# Altium project ArduinoProMini.PrjPcb
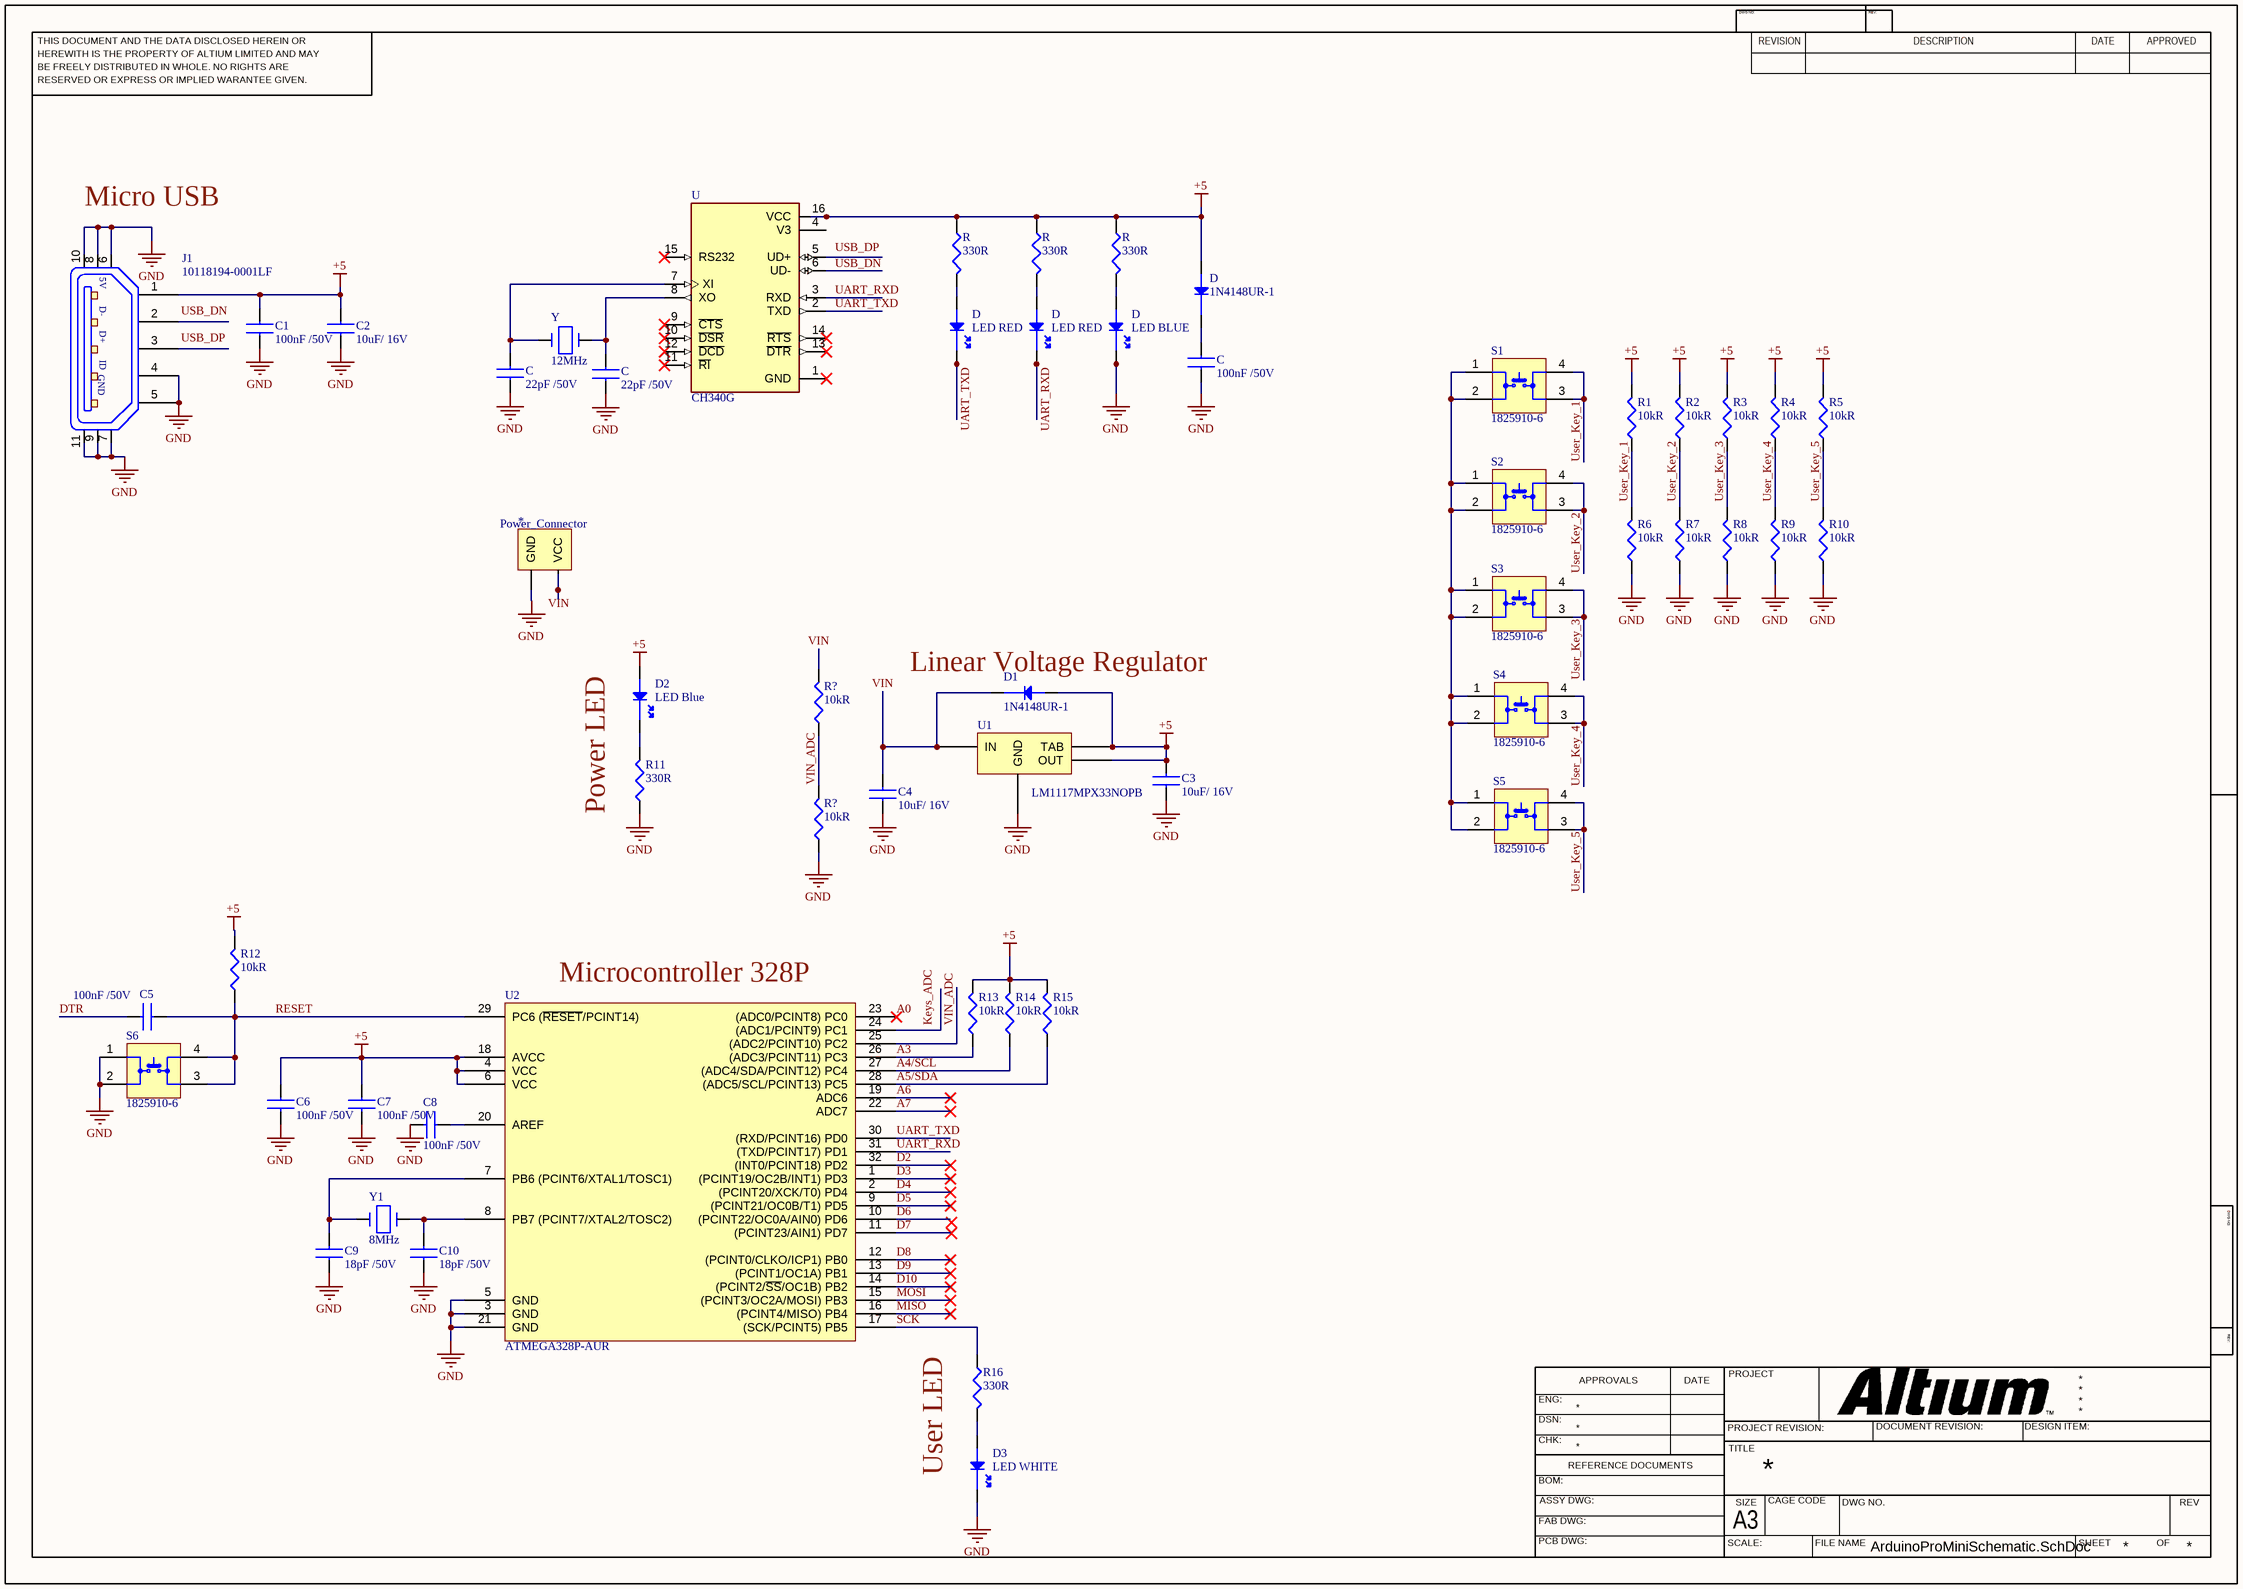
[diagram p0: ArduinoProMiniSchematic.SchDoc]
1 sheet, 54 parts. Net scope: global (net labels, ports and power ports of the same name join across sheets).
Board file: ArduinoProMiniPCB.PcbDoc

## Sheet ArduinoProMiniSchematic.SchDoc
size 420 x 297 mm

### Parts
(Parts that share a designator on the sheet are numbered #1, #2 ... from top to bottom, then left to right.)
*1  Power_Connector  [Power_Connector]
C1  100nF /50V  [C 0805]
C2  10uF/ 16V  [C 0805]
C3  10uF/ 16V  [C 0805]
C4  10uF/ 16V  [C 0805]
C5  100nF /50V  [C 0805]
C6  100nF /50V  [C 0805]
C7  100nF /50V  [C 0805]
C8  100nF /50V  [C 0805]
C9  18pF /50V  [C 0805]
C10  18pF /50V  [C 0805]
C#1  100nF /50V  [C 0805]
C#2  22pF /50V  [C 0805]
C#3  22pF /50V  [C 0805]
D1  1N4148UR-1  [DO-213AA]
D2  LED Blue  [LED 0603]
D3  LED WHITE  [LED 0603]
D#1  1N4148UR-1  [DO-213AA]
D#2  LED RED  [LED 0603]
D#3  LED RED  [LED 0603]
D#4  LED BLUE  [LED 0603]
J1  10118194-0001LF  [10118194-0001LF]
R1  10kR  [R 0805]
R2  10kR  [R 0805]
R3  10kR  [R 0805]
R4  10kR  [R 0805]
R5  10kR  [R 0805]
R6  10kR  [R 0805]
R7  10kR  [R 0805]
R8  10kR  [R 0805]
R9  10kR  [R 0805]
R10  10kR  [R 0805]
R11  330R  [R 0805]
R12  10kR
R13  10kR
R14  10kR
R15  10kR
R16  330R  [R 0805]
R#1  330R  [R 0805]
R#2  330R  [R 0805]
R#3  330R  [R 0805]
R?1  10kR  [R 0805]
R?2  10kR  [R 0805]
S1  1825910-6  [1825910-6]
S2  1825910-6  [1825910-6]
S3  1825910-6  [1825910-6]
S4  1825910-6  [1825910-6]
S5  1825910-6  [1825910-6]
S6  1825910-6  [1825910-6]
U  CH340G  [SOIC127P600X180-16N]
U1  LM1117MPX33NOPB  [SOT223]
U2  ATMEGA328P-AUR  [TQFP-32]
Y  12MHz  [CSM-7X]
Y1  8MHz  [CSM-7X]

### Nets
+5: C1.2 C2.2 C3.2 C6.2 C7.2 D1.1(anode) D2.1(anode) D#1.1(anode) J1.1 R1.2 R2.2 R3.2 R4.2 R5.2 R12.2 R13.2 R14.2 R15.2 R#1.1 R#2.1 R#3.1 U.16(VCC) U1.2(OUT) U1.4(TAB) U2.4(VCC) U2.6(VCC) U2.18(AVCC)
GND: *1.0(GND) C1.1 C2.1 C3.1 C4.1 C6.1 C7.1 C8.1 C9.1 C10.1 C#1.1 C#2.1 C#3.1 D3.2(cathode) D#4.2(cathode) J1.4 J1.5 J1.6 J1.7 J1.8 J1.9 J1.10 J1.11 R6.1 R7.1 R8.1 R9.1 R10.1 R11.1 R?2.1 S6.1 S6.2 U1.1(GND) U2.3(GND) U2.5(GND) U2.21(GND)
A0: U2.23((ADC0/PCINT8)_PC0)
A3: R13.1 U2.26((ADC3/PCINT11)_PC3)
A4/SCL: R14.1 U2.27((ADC4/SDA/PCINT12)_PC4)
A5/SDA: R15.1 U2.28((ADC5/SCL/PCINT13)_PC5)
A6: U2.19(ADC6)
A7: U2.22(ADC7)
D2: U2.32((INT0/PCINT18)_PD2)
D3: U2.1((PCINT19/OC2B/INT1)_PD3)
D4: U2.2((PCINT20/XCK/T0)_PD4)
D5: U2.9((PCINT21/OC0B/T1)_PD5)
D6: U2.10((PCINT22/OC0A/AIN0)_PD6)
D7: U2.11((PCINT23/AIN1)_PD7)
D8: U2.12((PCINT0/CLKO/ICP1)_PB0)
D9: U2.13((PCINT1/OC1A)_PB1)
D10: U2.14((PCINT2/~{SS}/OC1B)_PB2)
DTR: C5.1
MISO: U2.16((PCINT4/MISO)_PB4)
MOSI: U2.15((PCINT3/OC2A/MOSI)_PB3)
RESET: C5.2 R12.1 S6.3 S6.4 U2.29(PC6_(~{RESET}/PCINT14))
SCK: R16.1 U2.17((SCK/PCINT5)_PB5)
UART_RXD: D#3.2(cathode) U.3(RXD) U2.31((TXD/PCINT17)_PD1)
UART_TXD: D#2.2(cathode) U.2(TXD) U2.30((RXD/PCINT16)_PD0)
USB_DN: U.6(UD-)
User_Key_1: R1.1 R6.2 S1.3 S1.4
User_Key_2: R2.1 R7.2 S2.3 S2.4
User_Key_3: R3.1 R8.2 S3.3 S3.4
User_Key_4: R4.1 R9.2 S4.3 S4.4
User_Key_5: R5.1 R10.2 S5.3 S5.4
VIN_ADC: R?1.1 R?2.2 U2.25((ADC2/PCINT10)_PC2)
NetC4_2: C4.2 D1.2(cathode) U1.3(IN)
NetC8_2: C8.2 U2.20(AREF)
NetC9_2: C9.2 U2.7(PB6_(PCINT6/XTAL1/TOSC1)) Y1.1
NetC10_2: C10.2 U2.8(PB7_(PCINT7/XTAL2/TOSC2)) Y1.2
NetC#1_2: C#1.2 D#1.2(cathode)
NetC#2_2: C#2.2 U.7(XI) Y.1
NetC#3_2: C#3.2 U.8(XO) Y.2
NetD2_2: D2.2(cathode) R11.2
NetD3_1: D3.1(anode) R16.2
NetD#2_1: D#2.1(anode) R#1.2
NetD#3_1: D#3.1(anode) R#2.2
NetD#4_1: D#4.1(anode) R#3.2
NetS1_1: S1.1 S1.2 S2.1 S2.2 S3.1 S3.2 S4.1 S4.2 S5.1 S5.2

Not connected (* = marked no-connect by the designer): *1 1(VCC); J1 2 3; R?1 2; U 1(GND)* 4(V3) 5(UD+) 9(~{CTS})* 10(~{DSR})* 11(~{RI})* 12(~{DCD})* 13(~{DTR})* 14(~{RTS})* 15(RS232)*; U2 24((ADC1/PCINT9)_PC1)

### Notes on the sheet
- Micro USB
- (near D1) Linear Voltage Regulator
- Power LED
- (near U2) Microcontroller 328P
- User LED
- Labels drawn without touching a wire or pin: Keys_ADC, USB_DN, USB_DP, VIN
- THIS DOCUMENT AND THE DATA DISCLOSED HEREIN OR
- HEREWITH IS THE PROPERTY OF ALTIUM LIMITED AND MAY
- DWG NO:
- REVISION
- REV:
- DESCRIPTION
- DATE
- APPROVED
- BE FREELY DISTRIBUTED IN WHOLE. NO RIGHTS ARE
- RESERVED OR EXPRESS OR IMPLIED WARANTEE GIVEN.
- ENG:
- APPROVALS
- PROJECT
- DSN:
- CHK:
- REFERENCE DOCUMENTS
- PROJECT REVISION:
- TITLE
- DOCUMENT REVISION:
- DESIGN ITEM:
- BOM:
- FAB DWG:
- PCB DWG:
- ASSY DWG:
- SCALE:
- A3
- SIZE
- CAGE CODE
- FILE NAME
- DWG NO.
- SHEET
- OF
- REV
- (in symbol 10118194-0001LF) 5V; D-; D+; ID; GND

### Library data of the parts
C1 C5-C8 C#1 = C0805C104Z5VACTU: KEMET         C0805C104Z5VACTU.             CERAMIC CAPACITOR, 0.1UF, 50V, Y5V, +80,-20%, 0805; Tolerance: 80%; Dissipation Factor: 5%; Supplier 1: Digi-Key; Manufacturer 1: KEMET; Manufacturer Part Number 1: C0805C104Z5VACTU; RoHS: Yes; Category: Ceramic Capacitors; Stock 1: 1301254; Pricing 1: 1=0.10000, 10=0.05700, 100=0.02540, 500=0.01818, 1000=0.01428 (USD); Mount: Surface Mount,PCB; Case/Package: 0805; Number of Pins: 2; Dielectric Material: Ceramic; Case Code (Metric): 2012; Case Code (Imperial): 0805; Min Operating Temperature: -30°C; Max Operating Temperature: 85°C; Package Quantity: 1; Capacitance: 100nF; Voltage Rating: 50V; Packaging: Tape and Reel; Voltage Rating (DC): 50V; Dielectric: Y5V; Termination: SMD/SMT; Voltage: 50V; Length: 2mm; Height: 0.9mm; Lead Pitch: 0.75mm; Width: 0.049inch; Thickness: 0.039inch; Depth: 1.25mm; Radiation Hardening: No; REACH SVHC: No SVHC; Lead Free: Lead Free; ComponentLink1URL: https://datasheet.ciiva.com/14597/70095383-14597846.pdf?src-supplier=Allied+Electronics; ComponentLink1Description: https://datasheet.ciiva.com/14597/70095383-14597846.pdf?src-supplier=Allied+Electronics; ComponentLink2URL: https://datasheet.ciiva.com/18219/getdatasheetpartid-37101-18219255.pdf?src-supplier=Verical; ComponentLink2Description: https://datasheet.ciiva.com/18219/getdatasheetpartid-37101-18219255.pdf?src-supplier=Verical; ComponentLink3URL: https://datasheet.ciiva.com/26847/getdatasheetpartid-321176-26847799.pdf?src-supplier=Verical; ComponentLink3Description: https://datasheet.ciiva.com/26847/getdatasheetpartid-321176-26847799.pdf?src-supplier=Verical; ComponentLink4URL: https://datasheet.ciiva.com/14608/70095383-14608251.pdf?src-supplier=Allied+Electronics; ComponentLink4Description: https://datasheet.ciiva.com/14608/70095383-14608251.pdf?src-supplier=Allied+Electronics; ComponentLink5URL: https://datasheet.ciiva.com/7842/1470417-7842543.pdf?src-supplier=Element14; ComponentLink5Description: https://datasheet.ciiva.com/7842/1470417-7842543.pdf?src-supplier=Element14; Supplier Part Number 1: 399-1177-1-ND
C2-C4 = C0805C106K4PACTU: 0805 C 10uF Ceramic Multilayer Capacitor; 16 VDC; +85degC; X5R Dielec; +/-10%; Manufacturer 1: KEMET; Tolerance: 10%; Dissipation Factor: 5%; Supplier 1: Digi-Key; Manufacturer Part Number 1: C0805C106K4PACTU; RoHS: Yes; Category: Ceramic Capacitors; Stock 1: 383500; Pricing 1: 1=0.19000, 10=0.13100, 100=0.06630, 500=0.04538, 1000=0.04015 (USD); Mount: Surface Mount; Case/Package: 0805; Number of Pins: 2; Dielectric Material: Ceramic; Contact Plating: Tin,Matte; Case Code (Imperial): 0805; Case Code (Metric): 2012; Min Operating Temperature: -55°C; Max Operating Temperature: 85°C; Capacitance: 10uF; Packaging: Tape and Reel; Dielectric: X5R; Voltage: 16V; Termination: SMD/SMT; Voltage Rating (DC): 16V; Package Quantity: 1; Voltage Rating: 16V; Length: 2mm; Height: 1.25mm; Depth: 1.25mm; Width: 0.049inch; Thickness: 0.055inch; Radiation Hardening: No; Lead Free: Lead Free; REACH SVHC: No SVHC; ComponentLink1URL: https://datasheet.ciiva.com/7842/1732713-7842196.pdf?src-supplier=Element14; ComponentLink1Description: https://datasheet.ciiva.com/7842/1732713-7842196.pdf?src-supplier=Element14; ComponentLink2URL: https://datasheet.ciiva.com/28682/1831760-28682305.pdf?src-supplier=Element14; ComponentLink2Description: https://datasheet.ciiva.com/28682/1831760-28682305.pdf?src-supplier=Element14; ComponentLink3URL: https://datasheet.ciiva.com/11787/0900766b8116eb59-11787314.pdf?src-supplier=RSComponents; ComponentLink3Description: https://datasheet.ciiva.com/11787/0900766b8116eb59-11787314.pdf?src-supplier=RSComponents; ComponentLink4URL: https://datasheet.ciiva.com/7842/1732713-7842197.pdf?src-supplier=Element14; ComponentLink4Description: https://datasheet.ciiva.com/7842/1732713-7842197.pdf?src-supplier=Element14; ComponentLink5URL: https://datasheet.ciiva.com/26847/getdatasheetpartid-110990-26847815.pdf?src-supplier=Verical; ComponentLink5Description: https://datasheet.ciiva.com/26847/getdatasheetpartid-110990-26847815.pdf?src-supplier=Verical; Supplier Part Number 1: 399-8012-6-ND
C9 C10 = CC0805JRNPO9BN180: CAP CER 18PF 50V C0G/NPO 0805; Manufacturer 1: Yageo; Material: Ceramic; Tolerance: 5%; Dielectric: C0G; Insulation Resistance: 10GR; Supplier 1: Digi-Key; Manufacturer Part Number 1: CC0805JRNPO9BN180; RoHS: Yes; Category: Ceramic Capacitors; Stock 1: 89807; Pricing 1: 1=0.11000, 10=0.07900, 100=0.03520, 500=0.02514, 1000=0.01975 (USD); Mount: Surface Mount; Case/Package: 0805; Case Code (Metric): 2012; Case Code (Imperial): 0805; Min Operating Temperature: -55°C; Max Operating Temperature: 125°C; Package Quantity: 4000; Capacitance: 18pF; Voltage Rating: 50V; Packaging: Tape and Reel; Voltage Rating (DC): 50V; Termination: SMD/SMT; Composition: Ceramic; Length: 2mm; Height: 0.6mm; Width: 0.049inch; Thickness: 0.024inch; Depth: 1.25mm; Radiation Hardening: No; Lead Free: Lead Free; ComponentLink1URL: https://datasheet.ciiva.com/26862/getdatasheetpartid-403658-26862933.pdf?src-supplier=Verical; ComponentLink1Description: https://datasheet.ciiva.com/26862/getdatasheetpartid-403658-26862933.pdf?src-supplier=Verical; ComponentLink2URL: https://datasheet.ciiva.com/144/mlccorderingcode-144754.pdf?src-supplier=Digi-Key; ComponentLink2Description: https://datasheet.ciiva.com/144/mlccorderingcode-144754.pdf?src-supplier=Digi-Key; ComponentLink3URL: https://datasheet.ciiva.com/11586/upy-gp-np0-16v-to-50v-8-11586203.pdf?src-supplier=Avnet; ComponentLink3Description: https://datasheet.ciiva.com/11586/upy-gp-np0-16v-to-50v-8-11586203.pdf?src-supplier=Avnet; ComponentLink4URL: https://datasheet.ciiva.com/144/mlccorderingcode-144755.pdf?src-supplier=Digi-Key; ComponentLink4Description: https://datasheet.ciiva.com/144/mlccorderingcode-144755.pdf?src-supplier=Digi-Key; ComponentLink5URL: https://datasheet.ciiva.com/144/mlccorderingcode-144756.pdf?src-supplier=Digi-Key; ComponentLink5Description: https://datasheet.ciiva.com/144/mlccorderingcode-144756.pdf?src-supplier=Digi-Key; ComponentLink6URL: https://datasheet.ciiva.com/29241/445366-da-01-en-kerko-chip-0805-np0-18pf-5proz50v-g-29241990.pdf?src-supplier=Conrad; ComponentLink6Description: https://datasheet.ciiva.com/29241/445366-da-01-en-kerko-chip-0805-np0-18pf-5proz50v-g-29241990.pdf?src-supplier=Conrad; Supplier Part Number 1: 311-1102-1-ND
C#2 C#3 = CC0805JRNPO9BN180: CAP CER 18PF 50V C0G/NPO 0805; Manufacturer 1: Yageo; Tolerance: 5%; Dielectric: C0G; Insulation Resistance: 10GR; Supplier 1: Digi-Key; Manufacturer Part Number 1: CC0805JRNPO9BN180; RoHS: Yes; Category: Ceramic Capacitors; Stock 1: 89807; Pricing 1: 1=0.11000, 10=0.07900, 100=0.03520, 500=0.02514, 1000=0.01975 (USD); Mount: Surface Mount; Case/Package: 0805; Case Code (Metric): 2012; Case Code (Imperial): 0805; Material: Ceramic; Min Operating Temperature: -55°C; Max Operating Temperature: 125°C; Package Quantity: 4000; Capacitance: 18pF; Voltage Rating: 50V; Packaging: Tape and Reel; Voltage Rating (DC): 50V; Termination: SMD/SMT; Composition: Ceramic; Length: 2mm; Height: 0.6mm; Width: 0.049inch; Thickness: 0.024inch; Depth: 1.25mm; Radiation Hardening: No; Lead Free: Lead Free; ComponentLink1URL: https://datasheet.ciiva.com/26862/getdatasheetpartid-403658-26862933.pdf?src-supplier=Verical; ComponentLink1Description: https://datasheet.ciiva.com/26862/getdatasheetpartid-403658-26862933.pdf?src-supplier=Verical; ComponentLink2URL: https://datasheet.ciiva.com/144/mlccorderingcode-144754.pdf?src-supplier=Digi-Key; ComponentLink2Description: https://datasheet.ciiva.com/144/mlccorderingcode-144754.pdf?src-supplier=Digi-Key; ComponentLink3URL: https://datasheet.ciiva.com/11586/upy-gp-np0-16v-to-50v-8-11586203.pdf?src-supplier=Avnet; ComponentLink3Description: https://datasheet.ciiva.com/11586/upy-gp-np0-16v-to-50v-8-11586203.pdf?src-supplier=Avnet; ComponentLink4URL: https://datasheet.ciiva.com/144/mlccorderingcode-144755.pdf?src-supplier=Digi-Key; ComponentLink4Description: https://datasheet.ciiva.com/144/mlccorderingcode-144755.pdf?src-supplier=Digi-Key; ComponentLink5URL: https://datasheet.ciiva.com/144/mlccorderingcode-144756.pdf?src-supplier=Digi-Key; ComponentLink5Description: https://datasheet.ciiva.com/144/mlccorderingcode-144756.pdf?src-supplier=Digi-Key; ComponentLink6URL: https://datasheet.ciiva.com/29241/445366-da-01-en-kerko-chip-0805-np0-18pf-5proz50v-g-29241990.pdf?src-supplier=Conrad; ComponentLink6Description: https://datasheet.ciiva.com/29241/445366-da-01-en-kerko-chip-0805-np0-18pf-5proz50v-g-29241990.pdf?src-supplier=Conrad; Supplier Part Number 1: 311-1102-1-ND
D1 D#1 = 1N4148UR-1: Diode Switching 75V 0.2A 2-Pin DO-213AA; Manufacturer 1: Microsemi; Forward Voltage: 1.2V; Forward Current: 200mA; Peak Reverse Current: 500nA; Reverse Recovery Time: 5ns; Peak Non-Repetitive Surge Current: 2A; Element Configuration: Single; Supplier 1: Digi-Key; Manufacturer Part Number 1: 1N4148UR-1; RoHS: Yes; Category: Rectifier Diodes; Stock 1: 470; Pricing 1: 1=1.50000, 10=1.35200, 100=1.08630, 500=0.89250, 1000=0.73950, 2500=0.71400 (USD); Mount: Surface Mount; Number of Pins: 2; Min Operating Temperature: -65°C; Max Operating Temperature: 175°C; Packaging: Bulk; Average Rectified Current: 200mA; Max Repetitive Reverse Voltage (Vrrm): 75V; Max Reverse Voltage (DC): 75V; Radiation Hardening: No; Lead Free: Lead Free; ComponentLink1URL: https://datasheet.ciiva.com/3304/lds-0281-1-3304223.pdf?src-supplier=Avnet; ComponentLink1Description: https://datasheet.ciiva.com/3304/lds-0281-1-3304223.pdf?src-supplier=Avnet; Supplier Part Number 1: 1N4148UR-1-ND
D2 = LTST-C194TBKT: LED BLUE CLEAR SMD; Manufacturer 1: Vishay Lite-On; Lens Color: Colorless; Viewing Angle: 130°; Lens Style: Rectangular,Diffused,Colorless; Forward Current: 5mA; Forward Voltage: 3.8V; Luminous Intensity: 180mcd; Dominant Wavelength: 468nm; Test Current: 20mA; Number of Elements: 1; Power Dissipation: 76mW; Reverse Voltage: 5V; Supplier 1: Digi-Key; Manufacturer Part Number 1: LTST-C194TBKT; RoHS: Yes; Category: LEDs; Stock 1: 93526; Pricing 1: 1=0.45000, 10=0.32000, 100=0.14240, 500=0.09968, 1000=0.08188, 2500=0.07120 (USD); Mount: Surface Mount; Case/Package: 0603; Number of Pins: 2; Color: Blue; Case Code (Metric): 1608; Case Code (Imperial): 0603; Min Operating Temperature: -20°C; Max Operating Temperature: 80°C; Package Quantity: 1; Packaging: Tape and Reel; Illumination Color: Blue; Lens Transparency: Clear; Number of LEDs: 1; Length: 1.6mm; Height: 0.35mm; Width: 0.8mm; Depth: 0.8mm; Radiation Hardening: No; Lead Free: Lead Free; ComponentLink1URL: https://datasheet.ciiva.com/2115/ltst-c194tbkt-2115056.pdf?src-supplier=Digi-Key; ComponentLink1Description: https://datasheet.ciiva.com/2115/ltst-c194tbkt-2115056.pdf?src-supplier=Digi-Key; ComponentLink2URL: https://datasheet.ciiva.com/4689/lite-on-ltst-c194tbkt-187209-4689177.pdf?src-supplier=Mouser; ComponentLink2Description: https://datasheet.ciiva.com/4689/lite-on-ltst-c194tbkt-187209-4689177.pdf?src-supplier=Mouser; ComponentLink3URL: https://datasheet.ciiva.com/2115/s-110-ltst-c194tbkt-2115057.pdf?src-supplier=Digi-Key; ComponentLink3Description: https://datasheet.ciiva.com/2115/s-110-ltst-c194tbkt-2115057.pdf?src-supplier=Digi-Key; Supplier Part Number 1: 160-1837-1-ND
D3 D#2-D#4 = IN-S63AT5UW: LED WHITE CLEAR 0603 SMD; Manufacturer 1: Inolux; Supplier 1: Digi-Key; Manufacturer Part Number 1: IN-S63AT5UW; RoHS: No; Category: LEDs; Stock 1: 55075; Pricing 1: 1=0.35000, 10=0.25400, 100=0.12040, 500=0.08026, 1000=0.06286 (USD); ComponentLink1URL: http://www.inolux-corp.com/datasheet/SMDLED/Mono%20Color%20Top%20View/IN-S63AT%20Series_V1.1.pdf?src-supplier=Digi-Key; ComponentLink1Description: http://www.inolux-corp.com/datasheet/SMDLED/Mono%20Color%20Top%20View/IN-S63AT%20Series_V1.1.pdf?src-supplier=Digi-Key; Supplier Part Number 1: 1830-1063-1-ND
J1 = 10118194-0001LF: CONN RCPT USB2.0 MICRO B SMD R/A; Manufacturer 1: Amphenol FCI; Gender: Receptacle; Current Rating: 1.8A; Connector Type: USB,Receptacle; Number of Contacts: 5; Insulation Resistance: 1GR; Number of Ports: 1; Max Voltage Rating (AC): 100V; Pitch: 0.65mm; Supplier 1: Digi-Key; Manufacturer Part Number 1: 10118194-0001LF; RoHS: Yes; Category: Connectors; Stock 1: 31557; Pricing 1: 1=0.43000, 10=0.40500, 25=0.36440, 50=0.32400, 100=0.31040, 250=0.28344, 500=0.26994 (USD); Mount: Surface Mount,Horizontal; Contact Material: Copper Alloy; Contact Plating: Gold; Number of Terminals: 5; Housing Material: Polymer; Color: Black; Min Operating Temperature: -55°C; Max Operating Temperature: 85°C; Package Quantity: 9600; Packaging: Tape and Reel; Termination: Solder; Orientation: Right Angle; Features: Shielded; Length: 8.05mm; Depth: 5mm; Radiation Hardening: No; Lead Free: Lead Free; Flammability Rating: UL94 V-0; ComponentLink1URL: https://datasheet.ciiva.com/4598/10118194ac-197217-4598807.pdf?src-supplier=Mouser; ComponentLink1Description: https://datasheet.ciiva.com/4598/10118194ac-197217-4598807.pdf?src-supplier=Mouser; ComponentLink2URL: https://datasheet.ciiva.com/26945/getdatasheetpartid-418619-26945695.pdf?src-supplier=Verical; ComponentLink2Description: https://datasheet.ciiva.com/26945/getdatasheetpartid-418619-26945695.pdf?src-supplier=Verical; ComponentLink3URL: https://datasheet.ciiva.com/851/10118194-851110.pdf?src-supplier=Digi-Key; ComponentLink3Description: https://datasheet.ciiva.com/851/10118194-851110.pdf?src-supplier=Digi-Key; ComponentLink4URL: https://datasheet.ciiva.com/851/10118194-851111.pdf?src-supplier=Digi-Key; ComponentLink4Description: https://datasheet.ciiva.com/851/10118194-851111.pdf?src-supplier=Digi-Key; Supplier Part Number 1: 609-4618-1-ND
R1-R10 R12-R15 R?1 R?2 = RC0805FR-0710KL: RES SMD 10K OHM 1% 1/8W 0805; Manufacturer 1: Yageo; Temperature Coefficient: 100ppm/°C; Power Rating: 125mW; Voltage Rating: 150V; Supplier 1: Digi-Key; Manufacturer Part Number 1: RC0805FR-0710KL; RoHS: Yes; Category: Chip SMD Resistors; Stock 1: 37458313; Pricing 1: 1=0.10000, 10=0.03600, 100=0.01470, 1000=0.00660, 2500=0.00573 (USD); Case/Package: 0805; Case Code (Imperial): 0805; Case Code (Metric): 2012; Min Operating Temperature: -55°C; Max Operating Temperature: 155°C; Resistance: 10kR; Tolerance: 1%; Composition: Thick Film; Packaging: Tape and Reel; Package Quantity: 1; Termination: SMD/SMT; Number of Terminations: 2; Military Standard: Not; Max Power Dissipation: 125mW; Features: Moisture Resistant; Length: 2mm; Height: 0.024inch; Width: 0.049inch; Depth: 1.25mm; REACH SVHC: Unknown; Lead Free: Lead Free; ComponentLink1URL: https://datasheet.ciiva.com/11808/0900766b8106beab-11808151.pdf?src-supplier=RSComponents; ComponentLink1Description: https://datasheet.ciiva.com/11808/0900766b8106beab-11808151.pdf?src-supplier=RSComponents; ComponentLink2URL: https://datasheet.ciiva.com/12669/rc0805-12669688.pdf?src-supplier=Mouser; ComponentLink2Description: https://datasheet.ciiva.com/12669/rc0805-12669688.pdf?src-supplier=Mouser; ComponentLink3URL: https://datasheet.ciiva.com/46447/444164-46447563.pdf?src-supplier=Element14; ComponentLink3Description: https://datasheet.ciiva.com/46447/444164-46447563.pdf?src-supplier=Element14; ComponentLink4URL: https://datasheet.ciiva.com/2456/pyu-r-int-thick-7-2456972.pdf?src-supplier=Digi-Key; ComponentLink4Description: https://datasheet.ciiva.com/2456/pyu-r-int-thick-7-2456972.pdf?src-supplier=Digi-Key; ComponentLink5URL: https://datasheet.ciiva.com/2456/pyu-r-int-thick-7-2456973.pdf?src-supplier=Digi-Key; ComponentLink5Description: https://datasheet.ciiva.com/2456/pyu-r-int-thick-7-2456973.pdf?src-supplier=Digi-Key; ComponentLink6URL: https://datasheet.ciiva.com/2456/pyu-r-int-thick-7-2456974.pdf?src-supplier=Digi-Key; ComponentLink6Description: https://datasheet.ciiva.com/2456/pyu-r-int-thick-7-2456974.pdf?src-supplier=Digi-Key; ComponentLink7URL: https://datasheet.ciiva.com/16747/rc0805-16747087.pdf?src-supplier=Future+Electronics; ComponentLink7Description: https://datasheet.ciiva.com/16747/rc0805-16747087.pdf?src-supplier=Future+Electronics; Supplier Part Number 1: 311-10.0KCRCT-ND
R11 R16 R#1-R#3 = RC0805JR-07330RL: RES SMD 330 OHM 5% 1/8W 0805; Manufacturer 1: Yageo; Power Rating: 125mW; Voltage Rating: 150V; Temperature Coefficient: 100ppm/°C; Supplier 1: Digi-Key; Manufacturer Part Number 1: RC0805JR-07330RL; RoHS: Yes; Category: Chip SMD Resistors; Pricing 1: 1=0.10000, 10=0.03500, 100=0.01400, 1000=0.00631, 2500=0.00548 (USD); Case/Package: 0805; Case Code (Imperial): 0805; Case Code (Metric): 2012; Contact Plating: Tin,Matte,Lead; Min Operating Temperature: -55°C; Max Operating Temperature: 155°C; Package Quantity: 5000; Tolerance: 5%; Resistance: 330R; Packaging: Tape and Reel; Termination: SMD/SMT; Composition: Thick Film; Military Standard: Not; Length: 2mm; Height: 0.5mm; Width: 1.25mm; Depth: 1.25mm; Radiation Hardening: No; REACH SVHC: No SVHC; Lead Free: Lead Free; ComponentLink1URL: https://datasheet.ciiva.com/7941/442941-7941941.pdf?src-supplier=Element14; ComponentLink1Description: https://datasheet.ciiva.com/7941/442941-7941941.pdf?src-supplier=Element14; ComponentLink2URL: https://datasheet.ciiva.com/7941/442941-7941942.pdf?src-supplier=Element14; ComponentLink2Description: https://datasheet.ciiva.com/7941/442941-7941942.pdf?src-supplier=Element14; ComponentLink3URL: https://datasheet.ciiva.com/12555/rc0805-257173-12555078.pdf?src-supplier=Mouser; ComponentLink3Description: https://datasheet.ciiva.com/12555/rc0805-257173-12555078.pdf?src-supplier=Mouser; ComponentLink4URL: https://datasheet.ciiva.com/17008/rc0805-17008395.pdf?src-supplier=Future+Electronics; ComponentLink4Description: https://datasheet.ciiva.com/17008/rc0805-17008395.pdf?src-supplier=Future+Electronics; ComponentLink5URL: https://datasheet.ciiva.com/46395/444164-46395119.pdf?src-supplier=Element14; ComponentLink5Description: https://datasheet.ciiva.com/46395/444164-46395119.pdf?src-supplier=Element14; Supplier Part Number 1: 311-330ARCT-ND
  R11: Stock 1: 2403992
  R16 R#1-R#3: Stock 1: 2419541
S1-S6 = 1825910-6: ALCOSWITCH - TE CONNECTIVITY - 1825910-6 - TACT SWITCH, SPST, 0.05A, 24VDC, SOLDER; Manufacturer 1: TE Connectivity Alcoswitch; Mechanical Life: 100000Cycles; Actuator Material: PBT; Max Current Rating: 50mA; Operating Force: 160gf; Max Voltage Rating (DC): 24V; Contact Resistance: 100mR; Illumination Type: Non-Illuminated,Illuminated; Switch Travel: 0.25mm; Switch Function: Off-Mom; Actuator Type: Standard; Actuator Length: 0.055inch; Supplier 1: Digi-Key; Manufacturer Part Number 1: 1825910-6; RoHS: Yes; Category: Pushbutton Switches; Stock 1: 81468; Pricing 1: 1=0.10000, 10=0.10100, 25=0.09760, 50=0.09400, 100=0.08880, 250=0.08352, 500=0.08006, 1000=0.06091, 5000=0.05047 (USD); Mount: Through Hole; Contact Material: Copper Alloy; Contact Plating: Silver; Min Operating Temperature: -35°C; Max Operating Temperature: 85°C; Package Quantity: 750; Packaging: Loose Piece; Throw Configuration: SPST; Termination: PC Pins; Electrical Life: 100000Cycles; Orientation: Straight; Contact Current Rating: 50mA; Type: Switch; Length: 5.99mm; Lead Free: Lead Free; REACH SVHC: Unknown; ELV: Compliant; ComponentLink1URL: https://datasheet.ciiva.com/30199/1825910-6rqpn1825910-6-30199520.pdf?src-supplier=Onlinecomponents.com; ComponentLink1Description: https://datasheet.ciiva.com/30199/1825910-6rqpn1825910-6-30199520.pdf?src-supplier=Onlinecomponents.com; ComponentLink2URL: https://datasheet.ciiva.com/15184/getdatasheetpartid-395915-15184509.pdf?src-supplier=Verical; ComponentLink2Description: https://datasheet.ciiva.com/15184/getdatasheetpartid-395915-15184509.pdf?src-supplier=Verical; Supplier Part Number 1: 450-1650-ND
U = CH340G: USB Interface Integrated Circuit; MF: WCH; Value: *; SnapEDA_Link: https://www.snapeda.com/parts/Ch340G/WCH/view-part/?ref=snap; MP: Ch340G; Check_prices: https://www.snapeda.com/parts/Ch340G/WCH/view-part/?ref=eda; Availability: Not in stock; Price: None; Package: None
U1 = LM1117MPX33NOPB: IC REG LIN 3.3V 800MA SOT223-4; Manufacturer 1: TI National Semiconductor; Min Input Voltage: 2.6V; Max Input Voltage: 15V; Dropout Voltage: 1.2V; Number of Outputs: 1; Polarity: Positive; Quiescent Current: 10mA; Accuracy: 1%; Output Type: Fixed; Supplier 1: Digi-Key; Manufacturer Part Number 1: LM1117MPX33NOPB; RoHS: Yes; Category: Voltage Regulators - Linear; Mount: Surface Mount; Case/Package: SOT-223; Number of Pins: 4; Min Operating Temperature: 0°C; Max Operating Temperature: 125°C; Packaging: Tape and Reel; Output Current: 800mA; Output Voltage: 3.3V; Max Output Current: 800mA; Nominal Output Voltage: 3.3V; Output Voltage Accuracy: 1%; Current Rating: 800mA; Package Quantity: 2000; Number of Regulators: 1; Min Current Limit: 800mA; Length: 6.5mm; Height: 1.6mm; Width: 3.56mm; Radiation Hardening: No; REACH SVHC: No SVHC; Lead Free: Lead Free; ComponentLink1URL: https://datasheet.ciiva.com/34302/1282978-34302146.pdf?src-supplier=Jameco; ComponentLink1Description: https://datasheet.ciiva.com/34302/1282978-34302146.pdf?src-supplier=Jameco; ComponentLink2URL: https://datasheet.ciiva.com/15111/getdatasheetpartid-97931-15111685.pdf?src-supplier=Verical; ComponentLink2Description: https://datasheet.ciiva.com/15111/getdatasheetpartid-97931-15111685.pdf?src-supplier=Verical; ComponentLink3URL: https://datasheet.ciiva.com/6596/lm1117-n-6596790.pdf?src-supplier=Digi-Key; ComponentLink3Description: https://datasheet.ciiva.com/6596/lm1117-n-6596790.pdf?src-supplier=Digi-Key; ComponentLink4URL: https://datasheet.ciiva.com/25980/lm1117-n-25980326.pdf?src-supplier=Avnet+Europe; ComponentLink4Description: https://datasheet.ciiva.com/25980/lm1117-n-25980326.pdf?src-supplier=Avnet+Europe; ComponentLink5URL: https://datasheet.ciiva.com/3223/lm1117-n-3223528.pdf?src-supplier=Avnet; ComponentLink5Description: https://datasheet.ciiva.com/3223/lm1117-n-3223528.pdf?src-supplier=Avnet; ComponentLink6URL: https://datasheet.ciiva.com/22728/lm1117-n-22728808.pdf?src-supplier=Element14; ComponentLink6Description: https://datasheet.ciiva.com/22728/lm1117-n-22728808.pdf?src-supplier=Element14; ComponentLink7URL: https://datasheet.ciiva.com/3223/lm1117-n-3223529.pdf?src-supplier=Avnet; ComponentLink7Description: https://datasheet.ciiva.com/3223/lm1117-n-3223529.pdf?src-supplier=Avnet; ComponentLink8URL: https://datasheet.ciiva.com/6596/lm1117-n-6596793.pdf?src-supplier=Digi-Key; ComponentLink8Description: https://datasheet.ciiva.com/6596/lm1117-n-6596793.pdf?src-supplier=Digi-Key; Supplier Part Number 1: LM1117MPX-3.3/NOPBTR-ND
U2 = ATMEGA328P-AUR: MCU 8-bit ATmega AVR RISC 32KB Flash 2.5V/3.3V/5V 32-Pin TQFP T/R; Manufacturer 1: Microchip / Atmel; Frequency: 20MHz; Interface: I2C,SPI,UART,USART,2-Wire; Number of I/Os: 23; Oscillator Type: Internal; Peripherals: Brown-out Detect/Reset,POR,PWM,WDT; Min Supply Voltage: 1.8V; Max Supply Voltage: 5.5V; RAM Size: 2KB; Number of Timers/Counters: 3; Data Bus Width: 8b; Watchdog Timer: Yes; Supplier 1: Digi-Key; RoHS: Yes; Category: Microcontrollers; Stock 1: 12551; Pricing 1: 1=2.08000, 25=1.91000, 100=1.73000 (USD); Mount: Surface Mount; Case/Package: A; Number of Pins: 32; Contact Plating: Tin,Matte; Min Operating Temperature: -40°C; Max Operating Temperature: 85°C; Packaging: Tape and Reel; Memory Type: FLASH; Memory Size: 32KB; Core Architecture: AVR; Package Quantity: 2000; Number of Programmable I/O: 23; Max Frequency: 20MHz; REACH SVHC: No SVHC; Lead Free: Lead Free; ComponentLink1URL: https://datasheet.ciiva.com/6641/atmega48a-pa-88a-pa-168a-pa-328-p-ds-ds40002061a-6641009.pdf?src-supplier=Digi-Key; ComponentLink1Description: https://datasheet.ciiva.com/6641/atmega48a-pa-88a-pa-168a-pa-328-p-ds-ds40002061a-6641009.pdf?src-supplier=Digi-Key; Supplier Part Number 1: ATMEGA328P-AURCT-ND; Manufacturer Part Number 1: ATMEGA328P-AUR
Y = ECS-80-18-5PX-TR: CRYSTAL 8.0000MHZ 18PF SMD; Manufacturer 1: ECS International; Frequency: 8MHz; Tolerance: 30ppm; ESR (Equivalent Series Resistance): 60R; Frequency Stability: 50ppm; Supplier 1: Digi-Key; Manufacturer Part Number 1: ECS-80-18-5PX-TR; RoHS: Yes; Category: Crystals; Stock 1: 6700; Pricing 1: 1=0.25000, 10=0.21000, 50=0.18860, 100=0.16760, 500=0.15926 (USD); Mount: Surface Mount; Min Operating Temperature: -10°C; Max Operating Temperature: 70°C; Package Quantity: 1000; Load Capacitance: 18pF; Packaging: Tape and Reel; Frequency Tolerance: 30ppm; Termination: SMD/SMT; Length: 0.449inch; Height: 0.169inch; Width: 4.8mm; Lead Free: Lead Free; ComponentLink1URL: https://datasheet.ciiva.com/852/csm-7x-852380.pdf?src-supplier=Digi-Key; ComponentLink1Description: https://datasheet.ciiva.com/852/csm-7x-852380.pdf?src-supplier=Digi-Key; ComponentLink2URL: https://datasheet.ciiva.com/852/csm-7x-852381.pdf?src-supplier=Digi-Key; ComponentLink2Description: https://datasheet.ciiva.com/852/csm-7x-852381.pdf?src-supplier=Digi-Key; ComponentLink3URL: https://datasheet.ciiva.com/852/csm-7x-852382.pdf?src-supplier=Digi-Key; ComponentLink3Description: https://datasheet.ciiva.com/852/csm-7x-852382.pdf?src-supplier=Digi-Key; Supplier Part Number 1: XC1271CT-ND
Y1 = ECS-80-18-5PX-TR: CRYSTAL 8.0000MHZ 18PF SMD; Manufacturer 1: ECS International; Tolerance: 30ppm; ESR (Equivalent Series Resistance): 60R; Frequency Stability: 50ppm; Supplier 1: Digi-Key; Manufacturer Part Number 1: ECS-80-18-5PX-TR; RoHS: Yes; Category: Crystals; Stock 1: 6700; Pricing 1: 1=0.25000, 10=0.21000, 50=0.18860, 100=0.16760, 500=0.15926 (USD); Mount: Surface Mount; Min Operating Temperature: -10°C; Max Operating Temperature: 70°C; Package Quantity: 1000; Frequency: 8MHz; Load Capacitance: 18pF; Packaging: Tape and Reel; Frequency Tolerance: 30ppm; Termination: SMD/SMT; Length: 0.449inch; Height: 0.169inch; Width: 4.8mm; Lead Free: Lead Free; ComponentLink1URL: https://datasheet.ciiva.com/852/csm-7x-852380.pdf?src-supplier=Digi-Key; ComponentLink1Description: https://datasheet.ciiva.com/852/csm-7x-852380.pdf?src-supplier=Digi-Key; ComponentLink2URL: https://datasheet.ciiva.com/852/csm-7x-852381.pdf?src-supplier=Digi-Key; ComponentLink2Description: https://datasheet.ciiva.com/852/csm-7x-852381.pdf?src-supplier=Digi-Key; ComponentLink3URL: https://datasheet.ciiva.com/852/csm-7x-852382.pdf?src-supplier=Digi-Key; ComponentLink3Description: https://datasheet.ciiva.com/852/csm-7x-852382.pdf?src-supplier=Digi-Key; Supplier Part Number 1: XC1271CT-ND

## Assembly variants
ArduinoProMini: not fitted R3 R4